# Altium project AIO-Shield.PrjPcb
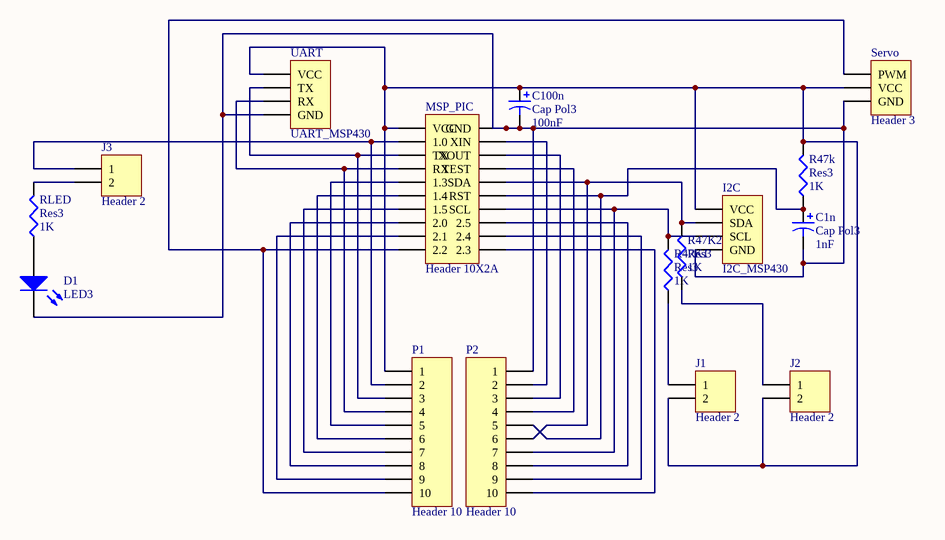
[diagram p0: Sheet_handling_module.SchDoc]
2 sheets, 38 parts. Net scope: global (net labels, ports and power ports of the same name join across sheets).
Board file: PCB1.PcbDoc
Sheets:
  Sheet_handling_module.SchDoc
  Sheet_AIO_Shield.SchDoc

## Sheet Sheet_handling_module.SchDoc
size A4

### Parts
C1n  Cap Pol3  value 1nF  [C0805]
C100n  Cap Pol3  value 100nF  [C0805]
D1  LED3  [6-0805_L]
I2C  I2C_MSP430  [HDR1X4]
J1  Header 2  [HDR1X2]
J2  Header 2  [HDR1X2]
J3  Header 2  [HDR1X2]
MSP_PIC  Header 10X2A  [N020]
P1  Header 10  [HDR1X10]
P2  Header 10  [HDR1X10]
R47k  Res3  value 1K  [INDC3216]
R47K1  Res3  value 1K  [INDC3216]
R47K2  Res3  value 1K  [INDC3216]
RLED  Res3  value 1K  [INDC3216]
Servo  Header 3  [HDR1X3]
UART  UART_MSP430  [HDR1X4]

### Nets
NetC1n_1: C1n.1 MSP_PIC.16(RST) P2.5 R47k.1
NetC1n_2: C1n.2 C100n.2 D1.2(K) I2C.1(GND) MSP_PIC.20(GND) P2.1 Servo.3(GND) UART.1(GND)
NetC100n_1: C100n.1 I2C.4(VCC) J1.2 J2.2 MSP_PIC.1(VCC) P1.1 R47k.2 Servo.2(VCC) UART.4(VCC)
NetD1_1: D1.1(A) RLED.1
NetI2C_2: I2C.2(SDA) MSP_PIC.15(SDA) P2.6 R47K2.2
NetI2C_3: I2C.3(SCL) MSP_PIC.14(SCL) P2.7 R47K1.2
NetJ1_1: J1.1 R47K1.1
NetJ2_1: J2.1 R47K2.1
NetJ3_1: J3.1 MSP_PIC.2(1.0) P1.2
NetJ3_2: J3.2 RLED.2
NetMSP_PIC_3: MSP_PIC.3(TX) P1.3 UART.2(TX)
NetMSP_PIC_4: MSP_PIC.4(RX) P1.4 UART.3(RX)
NetMSP_PIC_5: MSP_PIC.5(1.3) P1.5
NetMSP_PIC_6: MSP_PIC.6(1.4) P1.6
NetMSP_PIC_7: MSP_PIC.7(1.5) P1.7
NetMSP_PIC_8: MSP_PIC.8(2.0) P1.8
NetMSP_PIC_9: MSP_PIC.9(2.1) P1.9
NetMSP_PIC_10: MSP_PIC.10(2.2) P1.10 Servo.1(PWM)
NetMSP_PIC_11: MSP_PIC.11(2.3) P2.10
NetMSP_PIC_12: MSP_PIC.12(2.4) P2.9
NetMSP_PIC_13: MSP_PIC.13(2.5) P2.8
NetMSP_PIC_17: MSP_PIC.17(TEST) P2.4
NetMSP_PIC_18: MSP_PIC.18(XOUT) P2.3
NetMSP_PIC_19: MSP_PIC.19(XIN) P2.2

### Library data of the parts
C1n C100n = Cap Pol3: Polarized Capacitor (Surface Mount); Published: 8-Jun-2000; LatestRevisionDate: 29-May-2009; LatestRevisionNote: IPC-7351 Footprint Added.; PackageReference: C0805; Publisher: Altium Limited; PackageDescription: Chip Capacitor
D1 = LED3: Typical BLUE SiC LED; Published: 8-Jun-2000; LatestRevisionDate: 17-Dec-2003; LatestRevisionNote: PCB Footprint replaced.; DatasheetVersion: 16-Apr-2002; PackageVersion: 16-Apr-2002; PackageReference: 3.5X2.8X1.9; Publisher: Altium Limited; PackageDescription: SM LED; 2 C-Bend Leads; Body 3.5 x 2.8 x 1.9 mm, inc leads (LxWxH typ)
I2C UART = Header 4: Header, 4-Pin; LatestRevisionDate: 17-Jul-2002; LatestRevisionNote: Re-released for DXP Platform.; Publisher: Altium Limited
J1-J3 = Header 2: Header, 2-Pin; LatestRevisionDate: 17-Jul-2002; LatestRevisionNote: Re-released for DXP Platform.; Publisher: Altium Limited
MSP_PIC = Header 10X2A: Header, 10-Pin, Dual row; LatestRevisionDate: 17-Jul-2002; LatestRevisionNote: Re-released for DXP Platform.; Publisher: Altium Limited
P1 P2 = Header 10: Header, 10-Pin; LatestRevisionDate: 17-Jul-2002; LatestRevisionNote: Re-released for DXP Platform.; Publisher: Altium Limited
R47k R47K1 R47K2 RLED = Res3: Resistor; Published: 8-Jun-2000; LatestRevisionDate: 29-May-2009; LatestRevisionNote: IPC-7351 Footprint Added.; PackageReference: J1-0603; Publisher: Altium Limited; PackageDescription: Chip Resistor
Servo = Header 3: Header, 3-Pin; LatestRevisionDate: 17-Jul-2002; LatestRevisionNote: Re-released for DXP Platform.; Publisher: Altium Limited

## Sheet Sheet_AIO_Shield.SchDoc
size A4
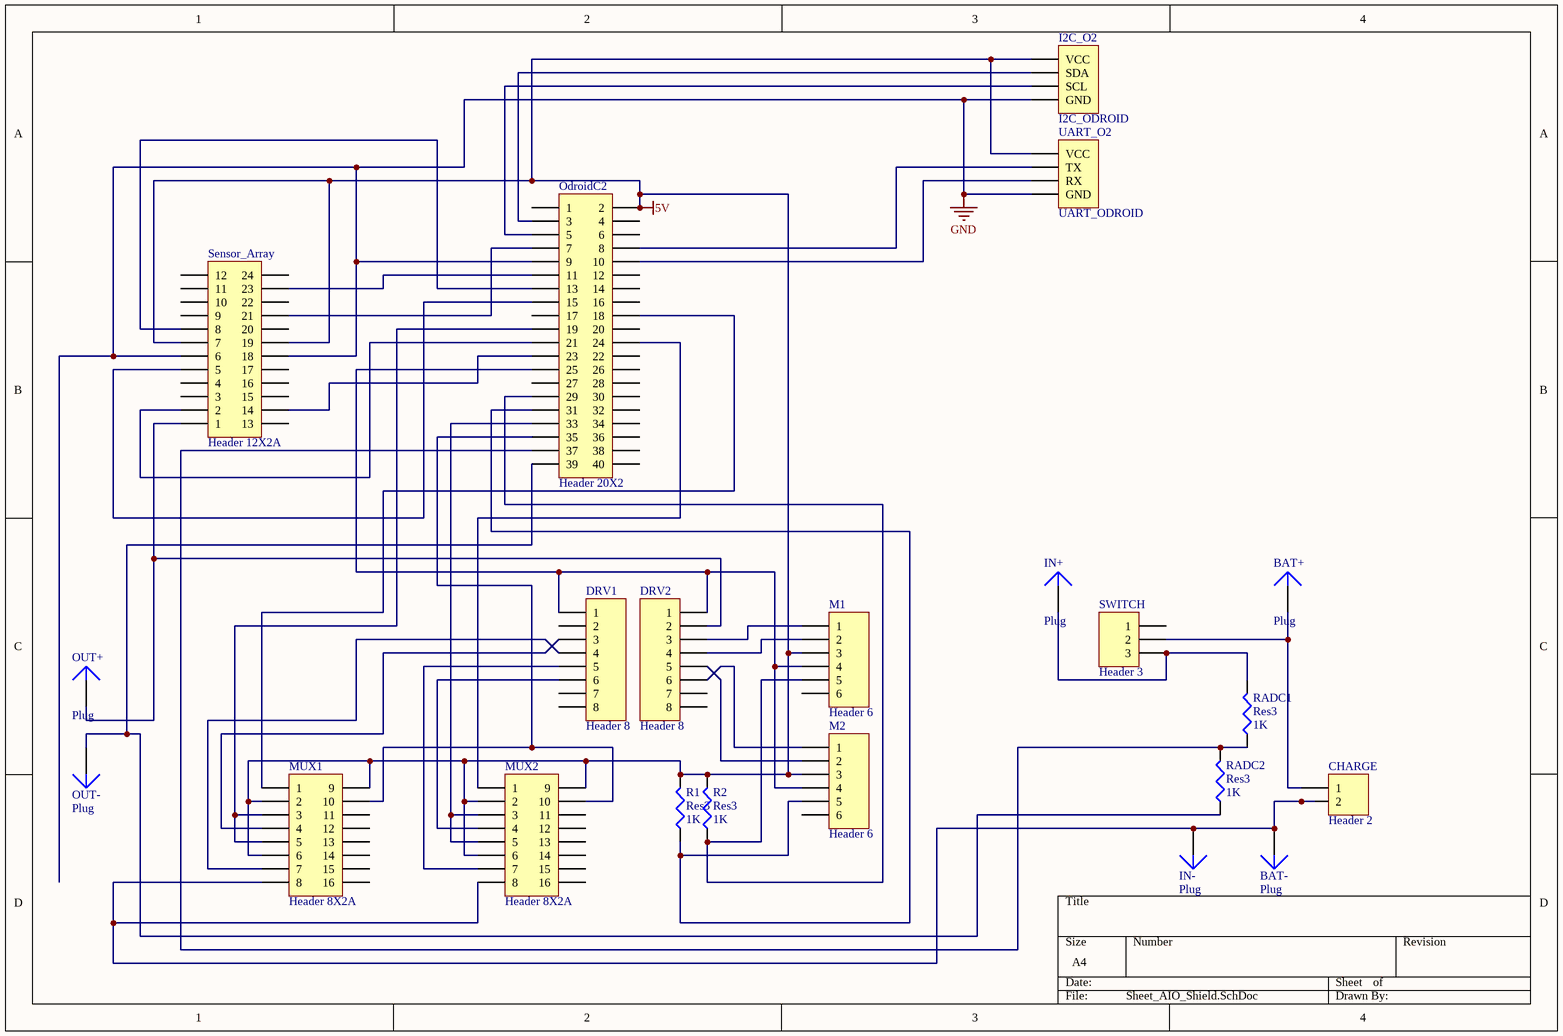
[diagram p1: Sheet_AIO_Shield.SchDoc]

### Parts
BAT+  Plug  [PIN1]
BAT-  Plug  [PIN1]
CHARGE  Header 2  [HDR1X2]
DRV1  Header 8  [HDR1X8]
DRV2  Header 8  [HDR1X8]
I2C_O2  I2C_ODROID  [HDR1X4]
IN+  Plug  [PIN1]
IN-  Plug  [PIN1]
M1  Header 6  [HDR1X6]
M2  Header 6  [HDR1X6]
MUX1  Header 8X2A  [N016]
MUX2  Header 8X2A  [N016]
OdroidC2  Header 20X2  [HDR2X20]
OUT+  Plug  [PIN1]
OUT-  Plug  [PIN1]
R1  Res3  value 1K  [INDC3216]
R2  Res3  value 1K  [INDC3216]
RADC1  Res3  value 1K  [INDC3216]
RADC2  Res3  value 1K  [INDC3216]
Sensor_Array  Header 12X2A  [HDR2X12_CEN]
SWITCH  Header 3  [HDR1X3]
UART_O2  UART_ODROID  [HDR1X4]

### Nets
5V: I2C_O2.1(VCC) M1.3 M2.3 MUX1.2 MUX1.6 MUX1.16(9) MUX2.2 MUX2.6 MUX2.16(9) OdroidC2.2 R1.2 R2.2 Sensor_Array.7 Sensor_Array.19 UART_O2.1(VCC)
GND: I2C_O2.4(GND) OdroidC2.9 Sensor_Array.6 Sensor_Array.18 UART_O2.4(GND)
NetBAT+_1: BAT+.1 CHARGE.1 SWITCH.2
NetBAT-_1: BAT-.1 CHARGE.2 IN-.1 MUX1.8 MUX2.8
NetDRV1_1: DRV1.1 DRV2.1 M1.4 M2.4 OdroidC2.25
NetDRV1_3: DRV1.3 MUX1.4
NetDRV1_4: DRV1.4 MUX1.7
NetDRV1_5: DRV1.5 MUX2.7
NetDRV1_6: DRV1.6 MUX2.4
NetDRV2_2: DRV2.2 OUT+.1 Sensor_Array.1
NetDRV2_3: DRV2.3 M1.1
NetDRV2_4: DRV2.4 M1.2
NetDRV2_5: DRV2.5 M2.2
NetDRV2_6: DRV2.6 M2.1
NetI2C_O2_2: I2C_O2.2(SDA) OdroidC2.3
NetI2C_O2_3: I2C_O2.3(SCL) OdroidC2.5
NetIN+_1: IN+.1 RADC1.2 SWITCH.3
NetM1_5: M1.5 OdroidC2.29 R2.1
NetM2_5: M2.5 OdroidC2.31 R1.1
NetMUX1_1: MUX1.1 OdroidC2.18
NetMUX1_3: MUX1.3 MUX1.5 OdroidC2.19
NetMUX1_15: MUX1.15(10) MUX2.15(10) OdroidC2.35
NetMUX2_1: MUX2.1 OdroidC2.24
NetMUX2_3: MUX2.3 MUX2.5 OdroidC2.33
NetOdroidC2_7: OdroidC2.7 Sensor_Array.21
NetOdroidC2_8: OdroidC2.8 UART_O2.3(TX)
NetOdroidC2_10: OdroidC2.10 UART_O2.2(RX)
NetOdroidC2_11: OdroidC2.11 Sensor_Array.23
NetOdroidC2_13: OdroidC2.13 Sensor_Array.8
NetOdroidC2_15: OdroidC2.15 Sensor_Array.5
NetOdroidC2_21: OdroidC2.21 Sensor_Array.2
NetOdroidC2_23: OdroidC2.23 Sensor_Array.14
NetOdroidC2_37: OdroidC2.37 RADC1.1 RADC2.2
NetOdroidC2_39: OdroidC2.39 OUT-.1 RADC2.1

Not connected (* = marked no-connect by the designer): DRV1 2 7 8; DRV2 7 8; M1 6; M2 6; MUX1 9(16) 10(15) 11(14) 12(13) 13(12) 14(11); MUX2 9(16) 10(15) 11(14) 12(13) 13(12) 14(11); OdroidC2 1 4 6 12 14 16 17 20 22 26 27 28 30 32 34 36 38 40; Sensor_Array 3 4 9 10 11 12 13 15 16 17 20 22 24; SWITCH 1

### Library data of the parts
CHARGE = Header 2: Header, 2-Pin; LatestRevisionDate: 17-Jul-2002; LatestRevisionNote: Re-released for DXP Platform.; Publisher: Altium Limited
DRV1 DRV2 = Header 8: Header, 8-Pin; LatestRevisionDate: 17-Jul-2002; LatestRevisionNote: Re-released for DXP Platform.; Publisher: Altium Limited
I2C_O2 UART_O2 = Header 4: Header, 4-Pin; LatestRevisionDate: 17-Jul-2002; LatestRevisionNote: Re-released for DXP Platform.; Publisher: Altium Limited
M1 M2 = Header 6: Header, 6-Pin; LatestRevisionDate: 17-Jul-2002; LatestRevisionNote: Re-released for DXP Platform.; Publisher: Altium Limited
MUX1 MUX2 = Header 8X2A: Header, 8-Pin, Dual row; LatestRevisionDate: 17-Jul-2002; LatestRevisionNote: Re-released for DXP Platform.; Publisher: Altium Limited
OdroidC2 = Header 20X2: Header, 20-Pin, Dual row; LatestRevisionDate: 17-Jul-2002; LatestRevisionNote: Re-released for DXP Platform.; Publisher: Altium Limited
R1 R2 RADC1 RADC2 = Res3: Resistor; Published: 8-Jun-2000; LatestRevisionDate: 29-May-2009; LatestRevisionNote: IPC-7351 Footprint Added.; PackageReference: J1-0603; Publisher: Altium Limited; PackageDescription: Chip Resistor
Sensor_Array = Header 12X2A: Header, 12-Pin, Dual row; LatestRevisionDate: 17-Jul-2002; LatestRevisionNote: Re-released for DXP Platform.; Publisher: Altium Limited
SWITCH = Header 3: Header, 3-Pin; LatestRevisionDate: 17-Jul-2002; LatestRevisionNote: Re-released for DXP Platform.; Publisher: Altium Limited
BAT+ BAT- IN+ IN- OUT+ OUT- = Plug: LatestRevisionDate: 17-Jul-2002; LatestRevisionNote: Re-released for DXP Platform.; Publisher: Altium Limited